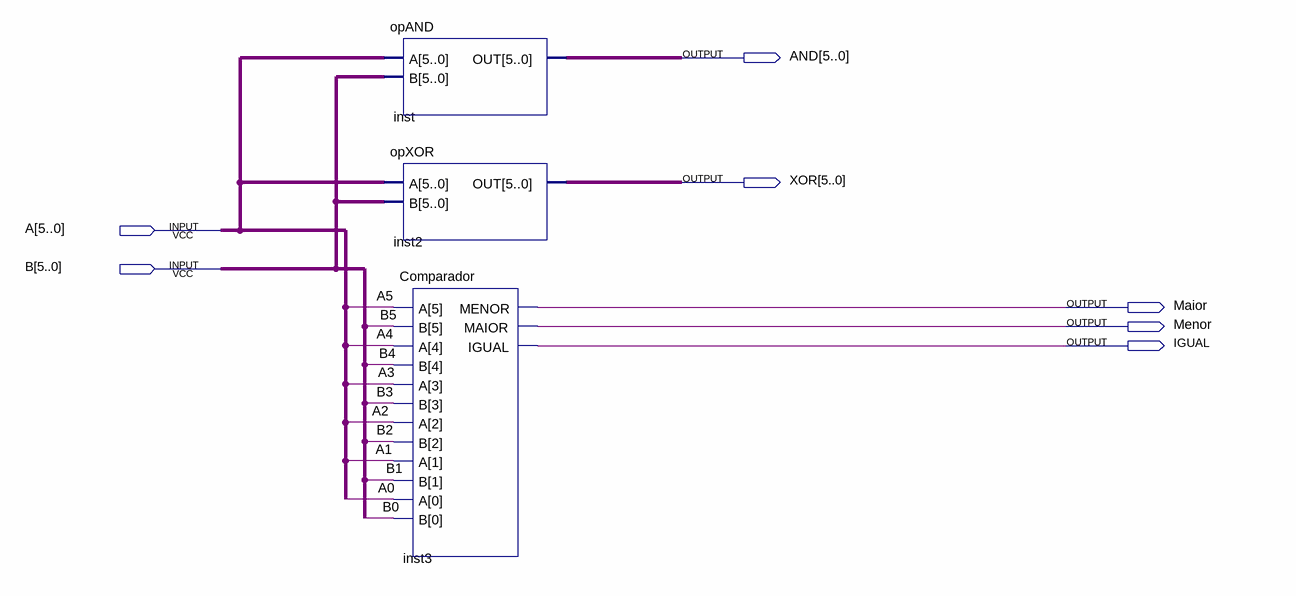
[diagram p0: schematic sheet]
// Quartus schematic UnidadeLogica.bdf as structural Verilog: 3 symbols, 7 pins
module UnidadeLogica (
  input  [5:0] A,
  input  [5:0] B,
  output [5:0] AND,
  output [5:0] XOR,
  output Maior,
  output Menor,
  output IGUAL
);

  opAND inst (.A(A), .B(B), .OUT(AND));
  opXOR inst2 (.A(A), .B(B), .OUT(XOR));
  Comparador inst3 (.A(A), .B(B), .MENOR(Maior), .MAIOR(Menor), .IGUAL(IGUAL));
endmodule
